# EasyEDA Pro project 扩展30.5V0.25_AT32F435_2025-06-26.epro, schematic IFLIGHT 435/405_0.25
Board Name: 扩展30.5V0.25_AT32F435; Create Date: 2025-06-26; Page Name: P1; Project Name: 低成本F405飞控; Schematic Name: IFLIGHT 435/405_0.25; Update Date: 2025-06-26; Company: 嘉立创EDA; Page Size: A4; Version: V1.0
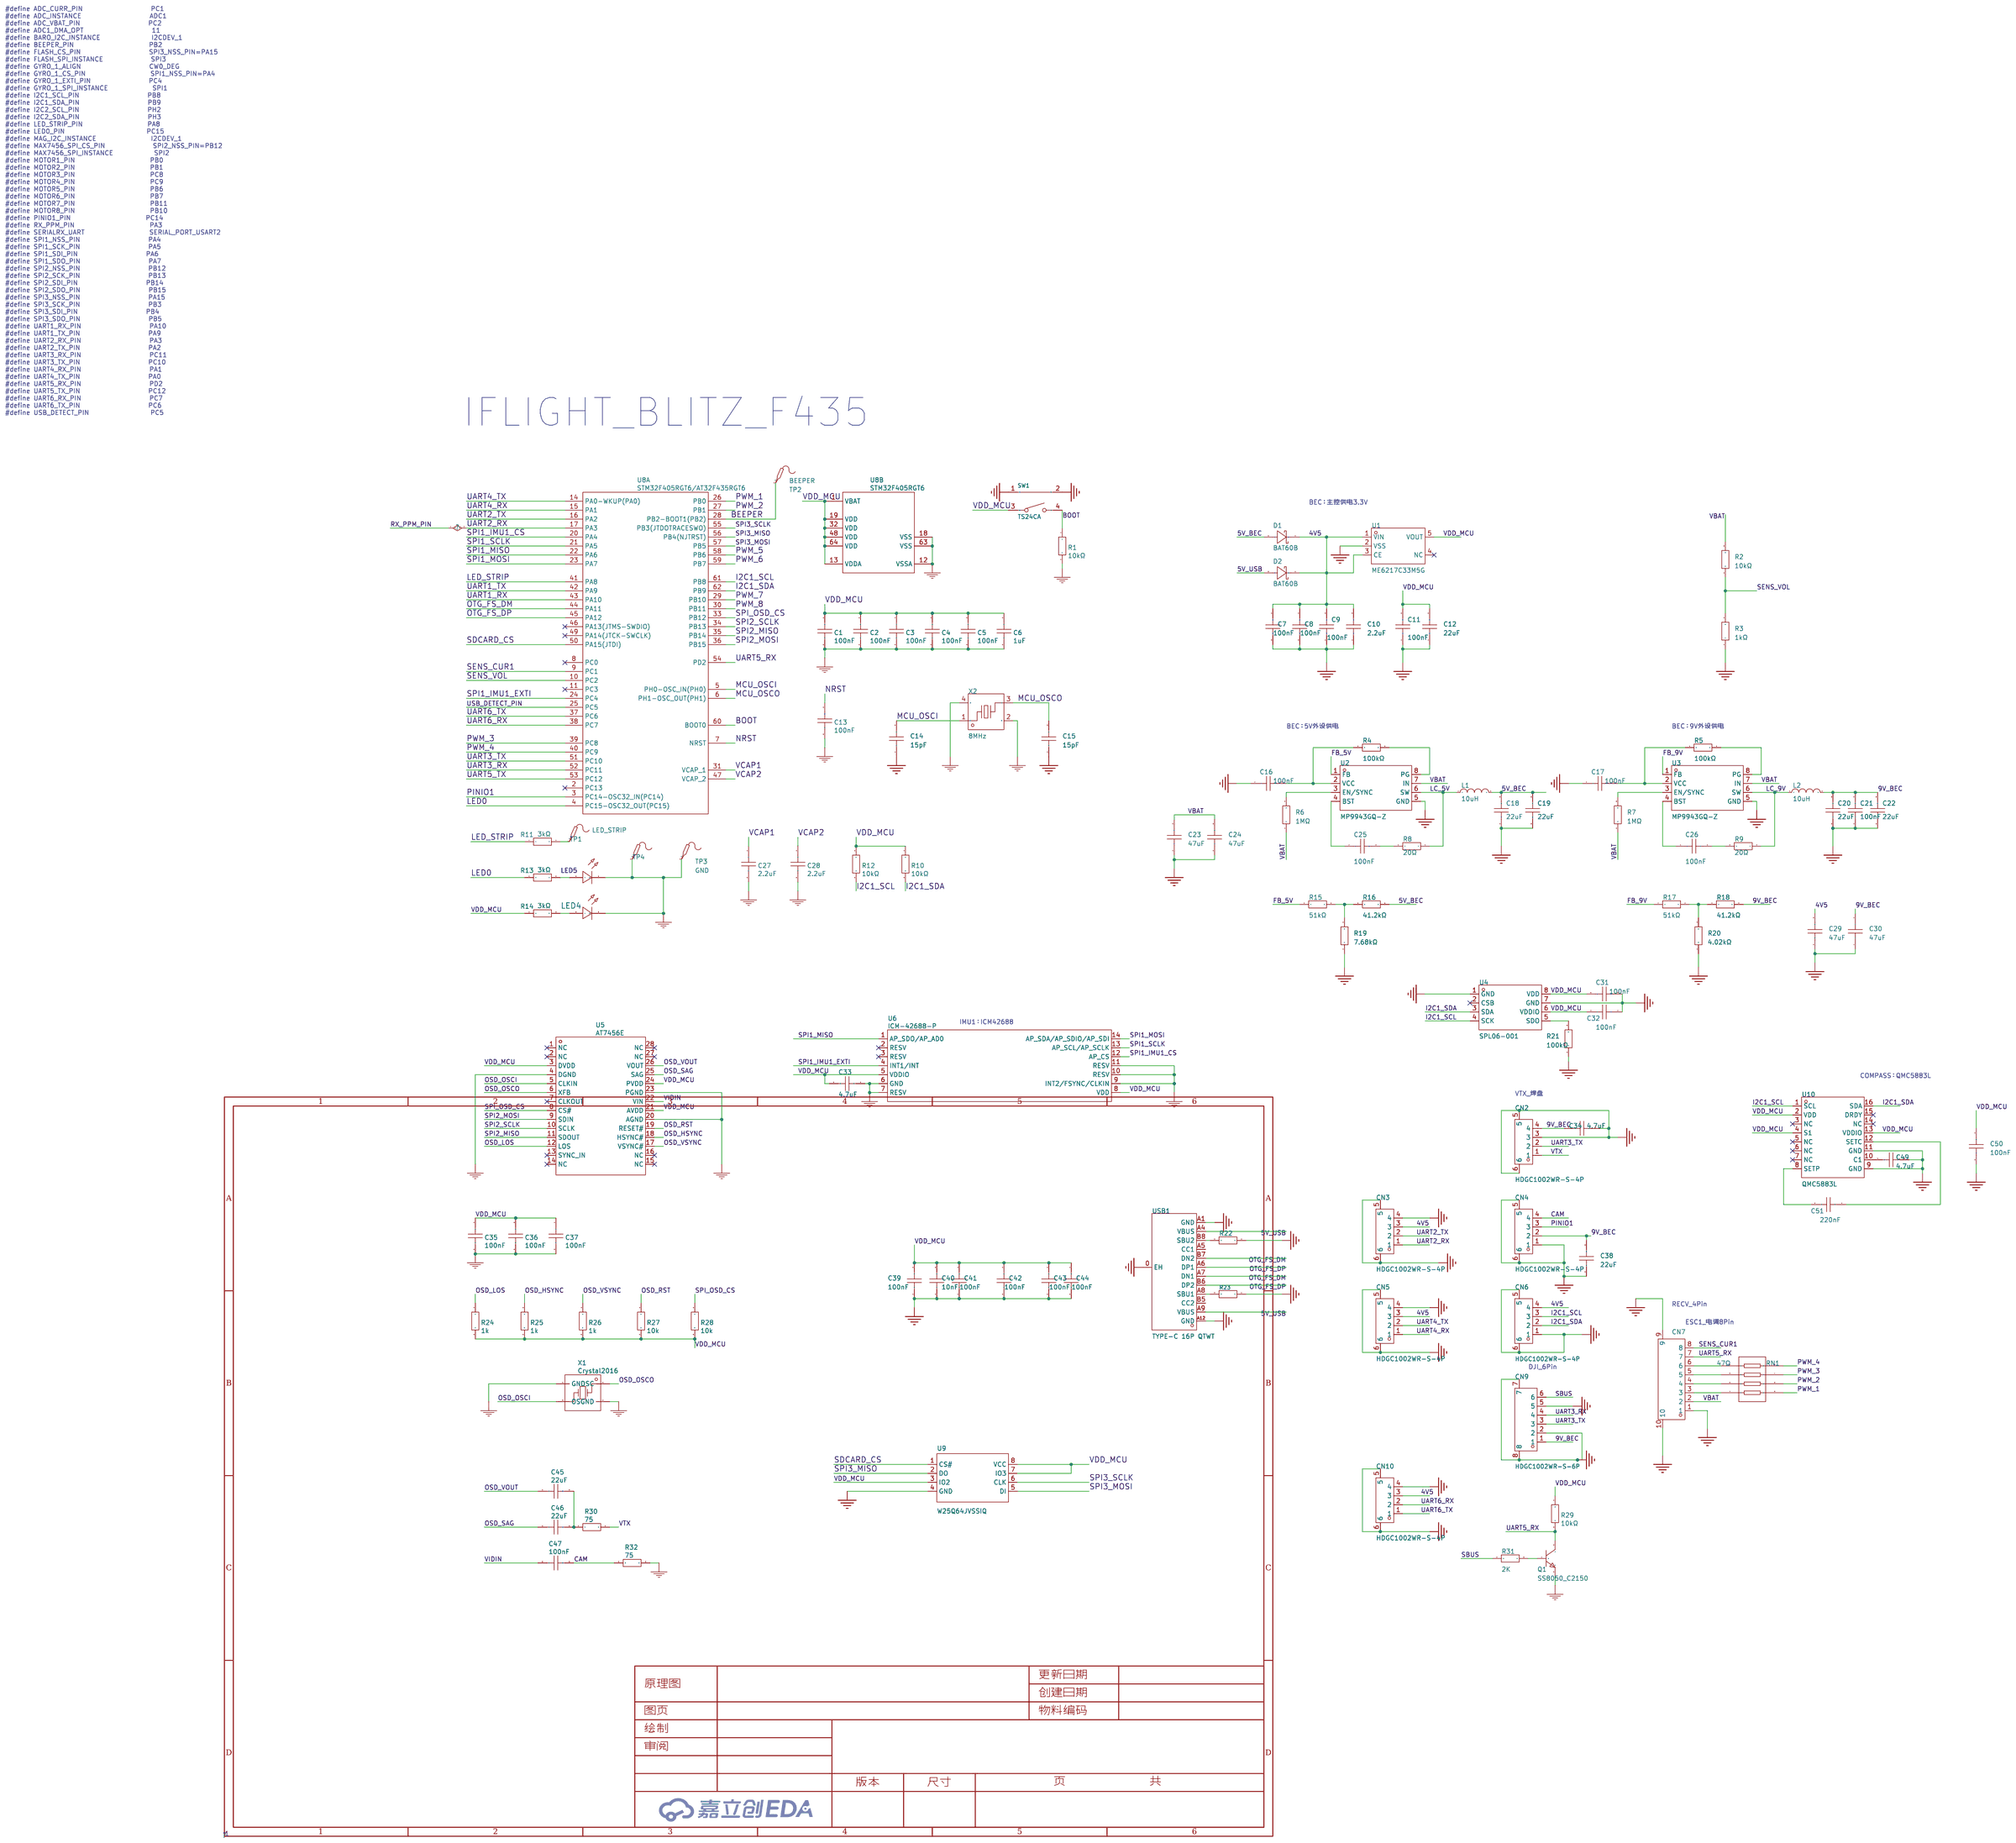
[diagram p0: schematic sheet]

## Parts
C1  100nF  [R0402]
C2  100nF  [R0402]
C3  100nF  [R0402]
C4  100nF  [R0402]
C5  100nF  [R0402]
C6  1uF  [R0402]
C7  100nF  [R0402]
C8  100nF  [R0402]
C9  100nF  [R0402]
C10  2.2uF  [R0402]
C11  100nF  [C0603]
C12  22uF  [C0603]
C13  100nF  [R0402]
C14  15pF  [C0402]
C15  15pF  [C0402]
C16  100nF  [C0402]
C17  100nF  [C0402]
C18  22uF  [C0603]
C19  22uF  [C0603]
C20  22uF  [C0603]
C21  100nF  [C0603]
C22  22uF  [C0603]
C23  47uF  [C1206]
C24  47uF  [C1206]
C25  100nF  [C0402]
C26  100nF  [C0402]
C27  2.2uF  [R0402]
C28  2.2uF  [R0402]
C29  47uF  [C1206]
C30  47uF  [C1206]
C31  100nF  [C0402]
C32  100nF  [C0402]
C33  4.7uF  [C0603]
C34  4.7uF  [C0603]
C35  100nF  [C0402]
C36  100nF  [C0402]
C37  100nF  [C0402]
C38  22uF  [C0805]
C39  100nF  [C0402]
C40  10nF  [C0402]
C41  100nF  [R0402]
C42  100nF  [R0402]
C43  100nF  [R0402]
C44  100nF  [R0402]
C45  22uF  [C0402]
C46  22uF  [C0402]
C47  100nF  [C0402]
C49  4.7uF  [C0603]
C50  100nF  [C0402]
C51  220nF  [C0402]
CN2  HDGC1002WR-S-4P  [CONN-SMD_4P-P1.00_HDGC_HDGC1002WR-S-4P]
CN3  HDGC1002WR-S-4P  [CONN-SMD_4P-P1.00_HDGC_HDGC1002WR-S-4P]
CN4  HDGC1002WR-S-4P  [CONN-SMD_4P-P1.00_HDGC_HDGC1002WR-S-4P]
CN5  HDGC1002WR-S-4P  [CONN-SMD_4P-P1.00_HDGC_HDGC1002WR-S-4P]
CN6  HDGC1002WR-S-4P  [CONN-SMD_4P-P1.00_HDGC_HDGC1002WR-S-4P]
CN7  HDGC1002WR-S-8P  [CONN-SMD_8P-P1.00_HDGC_HDGC1002WR-S-8P]
CN9  HDGC1002WR-S-6P  [CONN-SMD_6P-P1.00_HDGC1002WR-S-6P]
CN10  HDGC1002WR-S-4P  [CONN-SMD_4P-P1.00_HDGC_HDGC1002WR-S-4P]
D1  BAT60B  [SOD-323_L1.7-W1.3-LS2.6-RD-1]
D2  BAT60B  [SOD-323_L1.7-W1.3-LS2.6-RD-1]
L1  10uH  [IND-SMD_L4.4-W4.2]
L2  10uH  [IND-SMD_L4.4-W4.2]
LED4  -  [LED_0603]
LED5  -  [LED_0603]
Q1  SS8050_C2150  [SOT-23-3_L2.9-W1.3-P1.90-LS2.4-BR]
R1  10kΩ  [R0402]
R2  10kΩ  [R0402]
R3  1kΩ  [R0402]
R4  100kΩ  [R0402]
R5  100kΩ  [R0402]
R6  1MΩ  [R0402]
R7  1MΩ  [R0402]
R8  20Ω  [R0402]
R9  20Ω  [R0402]
R10  10kΩ  [R0402]
R11  3kΩ  [R0402]
R12  10kΩ  [R0402]
R13  3kΩ  [R0402]
R14  3kΩ  [R0402]
R15  51kΩ  [R0402]
R16  41.2kΩ  [R0402]
R17  51kΩ  [R0402]
R18  41.2kΩ  [R0402]
R19  7.68kΩ  [R0402]
R20  4.02kΩ  [R0402]
R21  100kΩ  [R0402]
R22  5.1kΩ  [R0402]
R23  5.1kΩ  [R0402]
R24  1k  [R0402]
R25  1k  [R0402]
R26  1k  [R0402]
R27  10k  [R0402]
R28  10k  [R0402]
R29  10kΩ  [R0402]
R30  75  [R0402]
R31  2K  [R0402]
R32  75  [R0402]
RN1  47Ω  [RES-ARRAY-SMD_0402-8P-L2.0-W1.0-BL]
SW1  TS24CA  [SW-SMD_TS24CA]
TP1  LED_STRIP  [Test-Point-0.5mm]
TP2  BEEPER  [Test-Point-0.5mm]
TP3  GND  [Test-Point-0.5mm]
TP4  -  [Test-Point-0.5mm]
U1  ME6217C33M5G  [SOT-23-5_L3.0-W1.7-P0.95-LS2.8-BR]
U2  MP9943GQ-Z  [QFN-8_L3.0-W3.0-P0.65-BL]
U3  MP9943GQ-Z  [QFN-8_L3.0-W3.0-P0.65-BL]
U4  SPL06-001  [SENSOR-SMD_SPL06-001]
U5  AT7456E  [AT7456E-SHORTER-FOOTPRINT]
U6  ICM-42688-P  [LGA-14_L3.0-W2.5-P0.50-TL]
U8  STM32F405RGT6/AT32F435RGT6  [LQFP-64_L10.0-W10.0-P0.50-LS12.0-BL]  (sections 1,2)
U9  W25Q64JVSSIQ  [SOP-8_L5.3-W5.3-P1.27-LS8.0-BL]
U10  QMC5883L  [LGA-16_L3.0-W3.0-P0.50-BL_SQ]
USB1  TYPE-C 16P QTWT  [USB-TYPE-C-SMD_TYPE-C-16P-QTWT]
X1  Crystal2016  [CRYSTAL2016]
X2  8MHz  [CRYSTAL-SMD_4P-L3.2-W2.5-BL]

## Library data of the parts
C1-C5 C7 C8 C13 C41-C44 = GRM155R71H104KE14D: 容值:100nF;精度:±10%;额定电压:50V;材质(温度系数):X7R;; LCSC Part Name: 100nF ±10% 50V; Supplier Part: C77020; Manufacturer: muRata(村田); Supplier Footprint: 0402; JLCPCB Part Class: Extended Part; Datasheet: https://atta.szlcsc.com/upload/public/pdf/source/20180326/C77020_39BD49C951FF1AF0DB1F1FAC5AC1E401.pdf; Supplier: LCSC; Tolerance: ±10%; Voltage Rated: 50V; Temperature Coefficient: X7R; 3DModel: C0402_L1.0-W0.5-H0.5
C6 = GRM155R61H105KE05D: 容值:1uF;精度:±10%;额定电压:50V;材质(温度系数):X5R;; LCSC Part Name: 1uF ±10% 50V; Supplier Part: C1518208; Manufacturer: muRata(村田); Supplier Footprint: 0402; JLCPCB Part Class: Extended Part; Datasheet: https://atta.szlcsc.com/upload/public/pdf/source/20210607/3F03D47137F6EC7729AB4067EB2A6EB3.pdf; Supplier: LCSC; Tolerance: ±10%; Voltage Rated: 50V; Temperature Coefficient: X5R; 3DModel: C0402_L1.0-W0.5-H0.5
C9 C16 C17 C25 C26 C31 C32 C39 C50 C51 = GRM155R71H104KE14D: 容值:100nF;精度:±10%;额定电压:50V;材质(温度系数):X7R;; LCSC Part Name: 100nF ±10% 50V; Supplier Part: C77020; Manufacturer: muRata(村田); Supplier Footprint: 0402; JLCPCB Part Class: Extended Part; Datasheet: https://atta.szlcsc.com/upload/public/pdf/source/20180326/C77020_39BD49C951FF1AF0DB1F1FAC5AC1E401.pdf; Supplier: LCSC; Tolerance: ±10%; Voltage Rated: 50V; Temperature Coefficient: X7R
C10 = CGA0402X5R225K350GT: 容值:2.2uF;精度:±10%;额定电压:35V;材质(温度系数):X5R;; LCSC Part Name: 2.2uF ±10% 35V; Supplier Part: C6119793; Manufacturer: HRE(芯声); Supplier Footprint: 0402; JLCPCB Part Class: Extended Part; Datasheet: https://atta.szlcsc.com/upload/public/pdf/source/20160218/1457707763339.pdf; Supplier: LCSC; Tolerance: ±10%; Voltage Rated: 35V; Temperature Coefficient: X5R
C11 C21 = 0603B104K500NT: 容值:100nF;精度:±10%;额定电压:50V;材质(温度系数):X7R;; LCSC Part Name: 100nF ±10% 50V; Supplier Part: C30926; Manufacturer: FH(风华); Supplier Footprint: 0603; JLCPCB Part Class: Extended Part; Datasheet: https://atta.szlcsc.com/upload/public/pdf/source/20200305/C486355_26A10D38EF8C2A5C37091D0039909270.pdf; Supplier: LCSC; Tolerance: ±10%; Voltage Rated: 50V; Temperature Coefficient: X7R
C12 C18-C20 C22 = CL10A226MQ8NRNC: 容值:22uF;精度:±20%;额定电压:6.3V;材质(温度系数):X5R;; LCSC Part Name: 22uF ±20% 6.3V; Supplier Part: C59461; Manufacturer: SAMSUNG(三星); Supplier Footprint: 0603; JLCPCB Part Class: Basic Part; Datasheet: https://atta.szlcsc.com/upload/public/pdf/source/20160218/1457707763339.pdf; Supplier: LCSC; Tolerance: ±20%; Voltage Rated: 6.3V; Temperature Coefficient: X5R
C14 C15 = CAP_0402: Supplier Footprint: 0402
C23 C24 C29 C30 = CL31A476MPHNNNE: 容值:47uF;精度:±20%;额定电压:10V;材质(温度系数):X5R;; LCSC Part Name: 47uF ±20% 10V; Supplier Part: C96123; Manufacturer: SAMSUNG(三星); Supplier Footprint: 1206; JLCPCB Part Class: Basic Part; Datasheet: https://atta.szlcsc.com/upload/public/pdf/source/20170228/1488267692219.pdf; Supplier: LCSC; Tolerance: ±20%; Voltage Rated: 10V; Temperature Coefficient: X5R
C27 C28 = CGA0402X5R225K350GT: 容值:2.2uF;精度:±10%;额定电压:35V;材质(温度系数):X5R;; LCSC Part Name: 2.2uF ±10% 35V; Supplier Part: C6119793; Manufacturer: HRE(芯声); Supplier Footprint: 0402; JLCPCB Part Class: Extended Part; Supplier: LCSC; Tolerance: ±10%; Voltage Rated: 35V; Temperature Coefficient: X5R; 3DModel: C0402_L1.0-W0.5-H0.5
C33 = 4.7uF: link: https://item.szlcsc.com/15869.html; 3DModel: C0402_L1.0-W0.5-H0.5; Supplier: LCSC; Supplier Part: C307423; Manufacturer: Samsung Electro-Mechanics; Manufacturer Part: CL05A475MQ5NRNC; JLCPCB Part Class: Extended Part
C34 C49 = CAP_0603: Supplier Footprint: 0603
C35-C37 C47 = 100nF: 3DModel: C0402_L1.0-W0.5-H0.5
C38 = CL21A226MAYNNNE: 容值:22uF;精度:±20%;额定电压:25V;材质(温度系数):X5R;; LCSC Part Name: 22uF ±20% 25V; Supplier Part: C602037; Manufacturer: SAMSUNG(三星); Supplier Footprint: 0805; JLCPCB Part Class: Extended Part; Datasheet: https://atta.szlcsc.com/upload/public/pdf/source/20200609/C602037_1A0D619693E608A1BF6E80154254E2DB.pdf; Supplier: LCSC; Tolerance: ±20%; Voltage Rated: 25V; Temperature Coefficient: X5R; Origin Footprint 2: 0805C
C40 = CC0402KRX7R9BB103: 容值:10nF;精度:±10%;额定电压:50V;材质(温度系数):X7R;; LCSC Part Name: 10nF ±10% 50V; Supplier Part: C60133; Manufacturer: YAGEO(国巨); Supplier Footprint: 0402; JLCPCB Part Class: Extended Part; Datasheet: https://atta.szlcsc.com/upload/public/pdf/source/20180224/C181747_15194369449651363981.pdf; Supplier: LCSC; Tolerance: ±10%; Voltage Rated: 50V; Temperature Coefficient: X7R
C45 C46 = CGA0402X5R226M100GT: 容值:22uF;精度:±20%;额定电压:10V;材质(温度系数):X5R;; LCSC Part Name: 22uF ±20% 10V; Supplier Part: C6119813; Manufacturer: HRE(芯声); Supplier Footprint: 0402; JLCPCB Part Class: Extended Part; Supplier: LCSC; Tolerance: ±20%; Voltage Rated: 10V; Temperature Coefficient: X5R; 3DModel: C0603_L1.6-W0.8-H0.8
CN2-CN6 CN10 = HDGC1002WR-S-4P: SH1.0针座卧贴 4P; LCSC Part Name: SH1.0针座卧贴 4P; Supplier Part: C2936214; Manufacturer: HDGC(华德共创); Supplier Footprint: SMD,P=1mm; JLCPCB Part Class: 扩展库; Datasheet: https://atta.szlcsc.com/upload/public/pdf/source/20211229/E8A09E85670B5E97244D2008A24D97FE.pdf; Supplier: LCSC
CN7 = HDGC1002WR-S-8P: 参考系列:SH;间距:1mm;排数:1;每排PIN数:8;公母:公型插针;安装方式:卧贴;额定电流:1A;工作温度范围:-40℃~+85℃;; LCSC Part Name: SH 1mm 卧贴; Supplier Part: C3041142; Manufacturer: HDGC(华德共创); Supplier Footprint: SMD,P=1mm; JLCPCB Part Class: 扩展库; Datasheet: https://atta.szlcsc.com/upload/public/pdf/source/20220621/C2AA6A1A2A279F73FC0521BA202CB6E2.pdf; Supplier: LCSC; Reference Series: SH; Pitch: 1mm; Number of Rows: 1; Number of PINs Per Row: 8; Gender: 公型插针; Mounting Style: 卧贴; Current Rating (Max): 1A; Operating Temperature Range: -40℃~+85℃
CN9 = HDGC1002WR-S-6P: 参考系列:SH;间距:1mm;排数:1;每排PIN数:6;公母:公型插针;安装方式:卧贴;额定电流:1A;工作温度范围:-40℃~+85℃;; LCSC Part Name: SH 1mm 卧贴; Supplier Part: C3041141; Manufacturer: HDGC(华德共创); Supplier Footprint: SMD,P=1mm; JLCPCB Part Class: 扩展库; Datasheet: https://atta.szlcsc.com/upload/public/pdf/source/20220621/C2AA6A1A2A279F73FC0521BA202CB6E2.pdf; Supplier: LCSC; Reference Series: SH; Pitch: 1mm; Number of Rows: 1; Number of PINs Per Row: 6; Gender: 公型插针; Mounting Style: 卧贴; Current Rating (Max): 1A; Operating Temperature Range: -40℃~+85℃
D1 = BAT60B_C7502695: 二极管配置:独立式;正向压降(Vf):600mV@1A;直流反向耐压(Vr):10V;整流电流:3A;; LCSC Part Name: 电压:10V 电流:3A; Supplier Part: C7502695; Manufacturer: 宏迦橙; Supplier Footprint: SOD-323; JLCPCB Part Class: Extended Part; Datasheet: https://atta.szlcsc.com/upload/public/pdf/source/20230828/25AE167151E881636AF68D9C9ECB5F9C.pdf; Supplier: LCSC; Diode Configuration: 独立式; Forward Voltage (Vf@If): 600mV@1A; Reverse Voltage (Vr): 10V; Rectified Current: 3A; Reverse Leakage Current (Ir): 25uA
D2 = BAT60B_C7502695: 二极管配置:独立式;正向压降(Vf):600mV@1A;直流反向耐压(Vr):10V;整流电流:3A;; LCSC Part Name: 电压:10V 电流:3A; Supplier Part: C7502695; Manufacturer: 宏迦橙; Supplier Footprint: SOD-323; JLCPCB Part Class: Extended Part; Datasheet: https://atta.szlcsc.com/upload/public/pdf/source/20230828/25AE167151E881636AF68D9C9ECB5F9C.pdf; Supplier: LCSC; Diode Configuration: 独立式; Forward Voltage (Vf@If): 600mV@1A; Reverse Voltage (Vr): 10V; Rectified Current: 3A; Reverse Leakage Current (Ir): 25uA; Average Rectified Current (Io): 3A
L1 L2 = FXL0420-100-M: 电感值:10uH;精度:±20%;额定电流:1.6A;饱和电流(Isat):2.2A;类型:一体成型电感;; LCSC Part Name: 10uH ±20% 2.2A; Supplier Part: C177242; Manufacturer: cjiang(长江微电); Supplier Footprint: SMD,4.2x4.4mm; JLCPCB Part Class: Extended Part; Datasheet: https://atta.szlcsc.com/upload/public/pdf/source/20200117/C485363_A2440626DC7482D75DD0DD56D1883FBF.pdf; Supplier: LCSC; Tolerance: ±20%; Rated Current: 1.6A; Saturation Current (Isat): 2.2A; DC Resistance (DCR): 282mΩ; Type: 一体成型电感
LED4 = LED_0603-R: Supplier Footprint: 0603
LED5 = LED_0603-G: Supplier Footprint: 0603
Q1 = SS8050_C2150: link: https://www.diodes.com/assets/Package-Files/SOT23.pdf; 3DModel: SOT-23-3P_L2.9-W1.3-H1.0-LS2.4-P0.95; Supplier: LCSC; Manufacturer: CJ; Manufacturer Part: SS8050; Supplier Part: C2150; JLCPCB Part Class: Basic Part
R1 R10 R12 R29 = RC0402FR-0710KL: 电阻类型:厚膜电阻;阻值:10kΩ;精度:±1%;功率:62.5mW;最大工作电压:50V;温度系数:±100ppm/℃;; LCSC Part Name: 厚膜电阻 10kΩ ±1% 62.5mW; Supplier Part: C60490; Manufacturer: YAGEO(国巨); Supplier Footprint: 0402; JLCPCB Part Class: Extended Part; Datasheet: https://atta.szlcsc.com/upload/public/pdf/source/20170925/C131467_1506321478108990263.pdf; Supplier: LCSC; Type: 厚膜电阻; Tolerance: ±1%; Power(Watts): 62.5mW; Overload Voltage (Max): 50V; Temperature Coefficient: ±100ppm/℃; Operating Temperature Range: -55℃~+155℃; 3DModel: R0402_L1.0-W0.5-H0.4
R2 = RC0402FR-0710KL: 电阻类型:厚膜电阻;阻值:10kΩ;精度:±1%;功率:62.5mW;最大工作电压:50V;温度系数:±100ppm/℃;; LCSC Part Name: 厚膜电阻 10kΩ ±1% 62.5mW; Supplier Part: C60490; Manufacturer: YAGEO(国巨); Supplier Footprint: 0402; JLCPCB Part Class: Extended Part; Datasheet: https://atta.szlcsc.com/upload/public/pdf/source/20170925/C131467_1506321478108990263.pdf; Supplier: LCSC; Type: 厚膜电阻; Tolerance: ±1%; Power(Watts): 62.5mW; Overload Voltage (Max): 50V; Temperature Coefficient: ±100ppm/℃; Operating Temperature Range: -55℃~+155℃
R3 = 0402WGF1001TCE: 电阻类型:厚膜电阻;阻值:1kΩ;精度:±1%;功率:62.5mW;最大工作电压:50V;温度系数:±100ppm/℃;; LCSC Part Name: 1kΩ ±1% 62.5mW 厚膜电阻; Supplier Part: C11702; Manufacturer: UNI-ROYAL(厚声); Supplier Footprint: 0402; JLCPCB Part Class: Basic Part; Datasheet: https://atta.szlcsc.com/upload/public/pdf/source/20200306/C422600_1E6D84923E4A46A82E41ADD87F860B5C.pdf; Supplier: LCSC; Type: 厚膜电阻; Tolerance: ±1%; Power(Watts): 62.5mW; Overload Voltage (Max): 50V; Temperature Coefficient: ±100ppm/℃; Operating Temperature Range: -55℃~+155℃
R4 R5 R21 = RC0402FR-07100KL: 电阻类型:厚膜电阻;阻值:100kΩ;精度:±1%;功率:62.5mW;最大工作电压:50V;温度系数:±100ppm/℃;; LCSC Part Name: 厚膜电阻 100kΩ ±1% 62.5mW; Supplier Part: C60491; Manufacturer: YAGEO(国巨); Supplier Footprint: 0402; JLCPCB Part Class: Extended Part; Datasheet: https://atta.szlcsc.com/upload/public/pdf/source/20180927/C295883_E8D83085EA81BD7DE0B2B681138C15EE.pdf; Supplier: LCSC; Type: 厚膜电阻; Tolerance: ±1%; Power(Watts): 62.5mW; Overload Voltage (Max): 50V; Temperature Coefficient: ±100ppm/℃; Operating Temperature Range: -55℃~+155℃
R6 R7 = 0402WGF1004TCE: 电阻类型:厚膜电阻;阻值:1MΩ;精度:±1%;功率:62.5mW;最大工作电压:50V;温度系数:±100ppm/℃;; LCSC Part Name: 1MΩ ±1% 62.5mW 厚膜电阻; Supplier Part: C26083; Manufacturer: UNI-ROYAL(厚声); Supplier Footprint: 0402; JLCPCB Part Class: Basic Part; Datasheet: https://atta.szlcsc.com/upload/public/pdf/source/20200306/C422600_1E6D84923E4A46A82E41ADD87F860B5C.pdf; Supplier: LCSC; Type: 厚膜电阻; Tolerance: ±1%; Power(Watts): 62.5mW; Overload Voltage (Max): 50V; Temperature Coefficient: ±100ppm/℃; Operating Temperature Range: -55℃~+155℃
R8 R9 = 0402WGF200JTCE: 电阻类型:厚膜电阻;阻值:20Ω;精度:±1%;功率:62.5mW;最大工作电压:50V;温度系数:±200ppm/℃;; LCSC Part Name: 20Ω ±1% 62.5mW 厚膜电阻; Supplier Part: C25089; Manufacturer: UNI-ROYAL(厚声); Supplier Footprint: 0402; JLCPCB Part Class: Extended Part; Datasheet: https://atta.szlcsc.com/upload/public/pdf/source/20200306/C422600_1E6D84923E4A46A82E41ADD87F860B5C.pdf; Supplier: LCSC; Type: 厚膜电阻; Tolerance: ±1%; Power(Watts): 62.5mW; Overload Voltage (Max): 50V; Temperature Coefficient: ±200ppm/℃; Operating Temperature Range: -55℃~+155℃
R11 R13 R14 = 0402WGF1001TCE: 电阻类型:厚膜电阻;阻值:1kΩ;精度:±1%;功率:62.5mW;最大工作电压:50V;温度系数:±100ppm/℃;; LCSC Part Name: 1kΩ ±1% 62.5mW 厚膜电阻; Supplier Part: C11702; Manufacturer: UNI-ROYAL(厚声); Supplier Footprint: 0402; JLCPCB Part Class: Basic Part; Datasheet: https://atta.szlcsc.com/upload/public/pdf/source/20200306/C422600_1E6D84923E4A46A82E41ADD87F860B5C.pdf; Supplier: LCSC; Type: 厚膜电阻; Tolerance: ±1%; Power(Watts): 62.5mW; Overload Voltage (Max): 50V; Temperature Coefficient: ±100ppm/℃; Operating Temperature Range: -55℃~+155℃; 3DModel: R0402_L1.0-W0.5-H0.4
R15 R17 = 0402WGF5102TCE: 电阻类型:厚膜电阻;阻值:51kΩ;精度:±1%;功率:62.5mW;最大工作电压:50V;温度系数:±100ppm/℃;; LCSC Part Name: 51kΩ ±1% 62.5mW 厚膜电阻; Supplier Part: C25794; Manufacturer: UNI-ROYAL(厚声); Supplier Footprint: 0402; JLCPCB Part Class: Basic Part; Datasheet: https://atta.szlcsc.com/upload/public/pdf/source/20200306/C422600_1E6D84923E4A46A82E41ADD87F860B5C.pdf; Supplier: LCSC; Type: 厚膜电阻; Tolerance: ±1%; Power(Watts): 62.5mW; Overload Voltage (Max): 50V; Temperature Coefficient: ±100ppm/℃; Operating Temperature Range: -55℃~+155℃
R16 R18 = 0402WGF4122TCE: 电阻类型:厚膜电阻;阻值:41.2kΩ;精度:±1%;功率:62.5mW;最大工作电压:50V;温度系数:±100ppm/℃;; LCSC Part Name: 41.2kΩ ±1% 62.5mW 厚膜电阻; Supplier Part: C26978; Manufacturer: UNI-ROYAL(厚声); Supplier Footprint: 0402; JLCPCB Part Class: Extended Part; Datasheet: https://atta.szlcsc.com/upload/public/pdf/source/20200306/C422600_1E6D84923E4A46A82E41ADD87F860B5C.pdf; Supplier: LCSC; Type: 厚膜电阻; Tolerance: ±1%; Power(Watts): 62.5mW; Overload Voltage (Max): 50V; Temperature Coefficient: ±100ppm/℃; Operating Temperature Range: -55℃~+155℃
R19 = 0402WGF7681TCE: 电阻类型:厚膜电阻;阻值:7.68kΩ;精度:±1%;功率:62.5mW;最大工作电压:50V;温度系数:±100ppm/℃;; LCSC Part Name: 7.68kΩ ±1% 62.5mW 厚膜电阻; Supplier Part: C25919; Manufacturer: UNI-ROYAL(厚声); Supplier Footprint: 0402; JLCPCB Part Class: Extended Part; Datasheet: https://atta.szlcsc.com/upload/public/pdf/source/20200306/C422600_1E6D84923E4A46A82E41ADD87F860B5C.pdf; Supplier: LCSC; Type: 厚膜电阻; Tolerance: ±1%; Power(Watts): 62.5mW; Overload Voltage (Max): 50V; Temperature Coefficient: ±100ppm/℃; Operating Temperature Range: -55℃~+155℃
R20 = 0402WGF4021TCE: 电阻类型:厚膜电阻;阻值:4.02kΩ;精度:±1%;功率:62.5mW;最大工作电压:50V;温度系数:±100ppm/℃;; LCSC Part Name: 4.02kΩ ±1% 62.5mW 厚膜电阻; Supplier Part: C43251; Manufacturer: UNI-ROYAL(厚声); Supplier Footprint: 0402; JLCPCB Part Class: Extended Part; Datasheet: https://atta.szlcsc.com/upload/public/pdf/source/20200306/C422600_1E6D84923E4A46A82E41ADD87F860B5C.pdf; Supplier: LCSC; Type: 厚膜电阻; Tolerance: ±1%; Power(Watts): 62.5mW; Overload Voltage (Max): 50V; Temperature Coefficient: ±100ppm/℃; Operating Temperature Range: -55℃~+155℃
R22 R23 = 0402WGF5101TCE: 电阻类型:厚膜电阻;阻值:5.1kΩ;精度:±1%;功率:62.5mW;最大工作电压:50V;温度系数:±100ppm/℃;; LCSC Part Name: 5.1kΩ ±1% 62.5mW 厚膜电阻; Supplier Part: C25905; Manufacturer: UNI-ROYAL(厚声); Supplier Footprint: 0402; JLCPCB Part Class: Basic Part; Datasheet: https://atta.szlcsc.com/upload/public/pdf/source/20200306/C422600_1E6D84923E4A46A82E41ADD87F860B5C.pdf; Supplier: LCSC; Type: 厚膜电阻; Tolerance: ±1%; Power(Watts): 62.5mW; Overload Voltage (Max): 50V; Temperature Coefficient: ±100ppm/℃; Operating Temperature Range: -55℃~+155℃; link: https://item.szlcsc.com/323315.html; 3DModel: R0402_L1.0-W0.5-H0.5; Resistance: 5.1K; Standardization Check: true
R24-R26 = 1k: 3DModel: R0402_L1.0-W0.5-H0.4; Supplier: LCSC
R27 R28 = 10k: 3DModel: R0402_L1.0-W0.5-H0.4; Supplier: LCSC
R30 R32 = 75: 3DModel: R0402_L1.0-W0.5-H0.4; Supplier: LCSC
R31 = Res_0402: Supplier Footprint: 0402
RN1 = AF124-JR-0747RL: 电阻器数:4;阻值:47Ω;精度:±5%;单个元件功率:62.5mW;温度系数:±200ppm/℃;; LCSC Part Name: 47Ω ±5% 0402x4; Supplier Part: C723467; Manufacturer: YAGEO(国巨); Supplier Footprint: 0402x4; JLCPCB Part Class: Extended Part; Datasheet: https://atta.szlcsc.com/upload/public/pdf/source/20200817/C723467_726CADB538F6405BDC12AAE9A767035C.pdf; Supplier: LCSC; Number of Resistors: 4; Tolerance: ±5%; Power(Watts): 62.5mW; Temperature Coefficient: ±200ppm/℃; Number of Pins: 8
SW1 = TS24CA: 触点电流:50mA;额定电压(DC):12V;电路结构:单刀单掷;安装方式:卧贴;带灯:-;机械寿命:-;; LCSC Part Name: 4.55*1.8*3.5mm 卧贴 轻触开关; Supplier Part: C393942; Manufacturer: SHOU HAN(首韩); Supplier Footprint: SMD; JLCPCB Part Class: 扩展库; Datasheet: https://atta.szlcsc.com/upload/public/pdf/source/20190521/C393942_591A9E318887EFA4274D34029981AD99.pdf; Supplier: LCSC; Contact Current: 50mA; Voltage Rating (DC): 12V; Circuit: 单刀单掷; Mounting Style: 卧贴; Actuator Style: 矩形按钮; Switch Length: 4.55mm; Switch Width: 1.8mm; Switch Height: 3.5mm
TP1-TP4 = Test-Point: Test Point 测试点
U1 = ME6217C33M5G: 输出类型:固定;输出极性:正;最大输入电压:7V;输出电压:3.3V;输出电流:800mA;电源纹波抑制比(PSRR):65dB@(1kHz);; Supplier Part: C427602; Manufacturer: MICRONE(南京微盟); Supplier Footprint: SOT-23-5; JLCPCB Part Class: 扩展库; Datasheet: https://atta.szlcsc.com/upload/public/pdf/source/20190910/C427602_D4B9162A2E9D9EF57C60010DFDECEF37.pdf; Supplier: LCSC; Output Type: 固定; Output Polarity: 正; Number of Outputs: 1; Maximum Input Voltage: 7V; Output Voltage: 3.3V; Dropout Voltage: 180mV@(300mA); Output Current: 800mA; Power Supply Rejection Ratio (PSRR): 65dB@(1kHz)
U2 U3 = MP9943GQ-Z: Supplier Part: C477821; Supplier Footprint: QFN-8_3x3mm; JLCPCB Part Class: 扩展库; Datasheet: 2021-05-22/374398S/94eb60b6438e46f987ac1f72df989e4b/MP9943.pdf; Supplier: LCSC; Standardization Check: true
U4 = SPL06-001_C2684428: LCSC Part Name: 普通气压传感器; Supplier Part: C2684428; Manufacturer: Goertek(歌尔); Supplier Footprint: SMD-8P,2x2.5mm; JLCPCB Part Class: 扩展库; Datasheet: https://atta.szlcsc.com/upload/public/pdf/source/20210120/C2684428_7EA58BBCA3793458F617124FBE4BF8F1.pdf; Supplier: LCSC
U5 = AT7456E: 3DModel: HTSSOP-28_L9.7-W4.4-P0.65-LS6.4-BL-EP-2
U6 = ICM-42688-P: 传感器类型:加速度计陀螺仪;; Supplier Part: C1850418; Manufacturer: TDK InvenSense(应美盛); Supplier Footprint: LGA-14(2.5x3); JLCPCB Part Class: 扩展库; Datasheet: https://atta.szlcsc.com/upload/public/pdf/source/20210703/CF24204867ACE5B754A2B035F23E5931.pdf; Supplier: LCSC; Sensor Type: 加速度计陀螺仪; link: https://lcsc.com/product-detail/Sensors_Bosch_BMG250_BMG250_C189521.html; 3DModel: LGA-14_L2.5-W3.0-H0.9-P0.50
U8 = STM32F405RGT6: link: https://item.szlcsc.com/92458.html; 3DModel: LQFP-64_L10.0-W10.0-H1.4-LS12.0-P0.50; tags: STM32; Supplier Part: C15742; Supplier: LCSC; Manufacturer: ST; image: http://image.lceda.cn/szlcsc/C15742.jpg; JLCPCB Part Class: Extended Part
U9 = W25Q64JVSSIQ_C83140: 接口类型:SPI;存储容量:-;时钟频率(fc):133MHz;; Supplier Part: C83140; Manufacturer: WINBOND(华邦); Supplier Footprint: SOP-8-208mil; JLCPCB Part Class: 扩展库; Datasheet: https://atta.szlcsc.com/upload/public/pdf/source/20161110/1478742546019.pdf; Supplier: LCSC; Interface: SPI; Clock Frequency: 133MHz; Voltage - Supply: 3V~3.6V; Page Programming Time (Tpp): 3ms; Data Retention - TDR (Year): 20年
U10 = QMC5883L: LCSC Part Name: 三轴磁传感器; Supplier Part: C976032; Manufacturer: QST(上海矽睿); Supplier Footprint: LGA-16(3x3x0.9); JLCPCB Part Class: 扩展库; Datasheet: https://atta.szlcsc.com/upload/public/pdf/source/20201217/C976032_5B9A2F3901E175046CBA037B1F18A1F2.pdf; Supplier: LCSC
USB1 = TYPE-C 16P QTWT: 连接器类型:Type-C;标准:-;公母:母;端口数量:1;触点数量:16P;安装方式:卧贴;额定电流 - 电源:3A;触头材质:-;触头镀层:-;工作温度范围:-25℃~+85℃;焊接温度(最大值):-;; LCSC Part Name: Type-C 母 卧贴; Supplier Part: C5187472; Manufacturer: SHOU HAN(首韩); Supplier Footprint: SMD; JLCPCB Part Class: 扩展库; Datasheet: https://atta.szlcsc.com/upload/public/pdf/source/20220929/9CA39B32C19F2C1116A695DA9353B6B2.pdf; Supplier: LCSC; Connector Type: Type-C; Gender: 母; Number of Ports: 1; Number of Contacts: 16P; Mounting Style: 卧贴; Current Rating - Power (Max): 3A; Operating Temperature Range: -25℃~+85℃
X1 = Crystal2016: 3DModel: OSC-SMD_4P-L2.0-W1.6-BL_X201624MKB4SI
X2 = X32258MSB4SI: 晶振类型:贴片晶振;频率:8MHz;常温频差:±10ppm;负载电容:20pF;频率稳定度:±20ppm;; LCSC Part Name: YSX321SL 8MHZ 4P 3225 20PF ±10PPM -40~85℃ (±20PPM); Supplier Part: C2682774; Manufacturer: YXC(扬兴晶振); Supplier Footprint: SMD3225-4P; JLCPCB Part Class: 扩展库; Datasheet: https://atta.szlcsc.com/upload/public/pdf/source/20240329/19D5F850207469550BEB00D7DFEDBC7A.pdf; Supplier: LCSC; Type: 贴片晶振; Normal temperature Frequency Tolerance: ±10ppm; Load Capacitance: 20pF; Frequency Stability: ±20ppm; Equivalent Series Resistance(ESR): 120Ω; Operating Temperature: -40℃~+85℃

## Nets
4V5: C7.1 C8.1 C9.2 C10.2 C29.2 CN3.3 CN5.3 CN6.4 CN10.3 D1.1(C) D2.1(C) U1.1(VIN) U1.3(CE)
5V_BEC: C18.2 C19.2 D1.2(A) L1.2 R16.2
5V_USB: D2.2(A) USB1.A4(VBUS) USB1.A9(VBUS)
9V_BEC: C20.2 C21.2 C22.2 C30.2 C34.1 C38.2 CN2.4 CN4.2 CN9.1 L2.2 R18.2
GND: C1.2 C2.2 C3.2 C4.2 C5.2 C6.2 C7.2 C8.2 C9.1 C10.1 C11.1 C12.1 C13.2 C14.1 C15.1 C16.1 C17.1 C18.1 C19.1 C20.1 C21.1 C22.1 C23.1 C24.1 C27.2 C28.2 C29.1 C30.1 C31.1 C32.1 C33.1 C34.2 C35.2 C36.2 C37.2 C38.1 C39.1 C40.1 C41.2 C42.2 C43.2 C44.2 C49.2 C50.2 CN2.3 CN2.5 CN2.6 CN3.4 CN3.5 CN3.6 CN4.1 CN4.5 CN4.6 CN5.4 CN5.5 CN5.6 CN6.1 CN6.5 CN6.6 CN7.1 CN7.9 CN7.10 CN9.2 CN9.5 CN9.7 CN9.8 CN10.4 CN10.5 CN10.6 LED4.1(C) LED5.1(C) Q1.2(E) R1.2 R3.1 R19.1 R20.1 R21.1 R22.1 R23.1 R32.2 SW1.1 SW1.2 TP3.1 TP4.1 U1.2(VSS) U2.5(GND) U3.5(GND) U4.1(GND) U4.7(GND) U5.4(DGND) U5.20(AGND) U5.23(PGND) U6.6(GND) U6.7(RESV) U6.9(INT2/FSYNC/CLKIN) U6.10(RESV) U6.11(RESV) U8.12(VSSA) U8.18(VSS) U8.63(VSS) U9.4(GND) U10.9(GND) U10.11(GND) USB1.0(EH) USB1.A1(GND) USB1.A12(GND) X1.2(GND) X1.4(GND) X2.2(GND) X2.4(GND)
VBAT: C23.2 C24.2 CN7.2 R2.2 R6.1 R7.1 U2.7(IN) U3.7(IN)
VDD_MCU: C1.1 C2.1 C3.1 C4.1 C5.1 C6.1 C11.2 C12.2 C31.2 C32.2 C33.2 C35.1 C36.1 C37.1 C39.2 C40.2 C41.1 C42.1 C43.1 C44.1 C50.1 R10.1 R12.1 R14.1 R24.2 R25.2 R26.2 R27.2 R28.2 R29.1 SW1.3 U1.5(VOUT) U4.6(VDDIO) U4.8(VDD) U5.3(DVDD) U5.21(AVDD) U5.24(PVDD) U6.5(VDDIO) U6.8(VDD) U8.1(VBAT) U8.13(VDDA) U8.19(VDD) U8.32(VDD) U8.48(VDD) U8.64(VDD) U9.3(IO2) U9.7(IO3) U9.8(VCC) U10.2(VDD) U10.4(S1) U10.13(VDDIO)
BEEPER: TP2.1 U8.28(PB2-BOOT1(PB2))
BOOT: R1.1 SW1.4 U8.60(BOOT0)
CAM: C47.2 CN4.4 R32.1
FB_5V: R15.1 U2.1(FB)
FB_9V: R17.1 U3.1(FB)
I2C1_SCL: CN6.3 R12.2 U4.4(SCK) U8.61(PB8) U10.1(SCL)
I2C1_SDA: CN6.2 R10.2 U4.3(SDA) U8.62(PB9) U10.16(SDA)
LC_5V: L1.1 R8.1 U2.6(SW)
LC_9V: L2.1 R9.1 U3.6(SW)
LED0: R13.1 U8.4(PC15-OSC32_OUT(PC15))
LED_STRIP: R11.1 U8.41(PA8)
MCU_OSCI: C14.2 U8.5(PH0-OSC_IN(PH0)) X2.1
MCU_OSCO: C15.2 U8.6(PH1-OSC_OUT(PH1)) X2.3
NRST: C13.1 U8.7(NRST)
OSD_HSYNC: R25.1 U5.18(HSYNC#)
OSD_LOS: R24.1 U5.12(LOS)
OSD_OSCI: U5.5(CLKIN) X1.3(OSC)
OSD_OSCO: U5.6(XFB) X1.1(OSC)
OSD_RST: R27.1 U5.19(RESET#)
OSD_SAG: C46.1 U5.25(SAG)
OSD_VOUT: C45.1 U5.26(VOUT)
OSD_VSYNC: R26.1 U5.17(VSYNC#)
OTG_FS_DM: U8.44(PA11) USB1.A7(DN1) USB1.B7(DN2)
OTG_FS_DP: U8.45(PA12) USB1.A6(DP1) USB1.B6(DP2)
PINIO1: CN4.3 U8.3(PC14-OSC32_IN(PC14))
PWM_1: RN1.5 U8.26(PB0)
PWM_2: RN1.6 U8.27(PB1)
PWM_3: RN1.7 U8.39(PC8)
PWM_4: RN1.8 U8.40(PC9)
PWM_5: U8.58(PB6)
PWM_6: U8.59(PB7)
PWM_7: U8.29(PB10)
PWM_8: U8.30(PB11)
RX_PPM_PIN: CN3.1 U8.17(PA3)
SBUS: CN9.6 R31.1
SDCARD_CS: U8.50(PA15(JTDI)) U9.1(CS#)
SENS_CUR1: CN7.8 U8.9(PC1)
SENS_VOL: R2.1 R3.2 U8.10(PC2)
SPI1_IMU1_CS: U6.12(AP_CS) U8.20(PA4)
SPI1_IMU1_EXTI: U6.4(INT1/INT) U8.24(PC4)
SPI1_MISO: U6.1(AP_SDO/AP_AD0) U8.22(PA6)
SPI1_MOSI: U6.14(AP_SDA/AP_SDIO/AP_SDI) U8.23(PA7)
SPI1_SCLK: U6.13(AP_SCL/AP_SCLK) U8.21(PA5)
SPI2_MISO: U5.11(SDOUT) U8.35(PB14)
SPI2_MOSI: U5.9(SDIN) U8.36(PB15)
SPI2_SCLK: U5.10(SCLK) U8.34(PB13)
SPI3_MISO: U8.56(PB4(NJTRST)) U9.2(DO)
SPI3_MOSI: U8.57(PB5) U9.5(DI)
SPI3_SCLK: U8.55(PB3(JTDOTRACESWO)) U9.6(CLK)
SPI_OSD_CS: R28.1 U5.8(CS#) U8.33(PB12)
UART1_RX: U8.43(PA10)
UART1_TX: U8.42(PA9)
UART2_TX: CN3.2 U8.16(PA2)
UART3_RX: CN9.4 U8.52(PC11)
UART3_TX: CN2.2 CN9.3 U8.51(PC10)
UART4_RX: CN5.1 U8.15(PA1)
UART4_TX: CN5.2 U8.14(PA0-WKUP(PA0))
UART5_RX: CN7.7 Q1.3(C) R29.2 U8.54(PD2)
UART5_TX: U8.53(PC12)
UART6_RX: CN10.2 U8.38(PC7)
UART6_TX: CN10.1 U8.37(PC6)
USB_DETECT_PIN: U8.25(PC5)
VCAP1: C27.1 U8.31(VCAP_1)
VCAP2: C28.1 U8.47(VCAP_2)
VIDIN: C47.1 U5.22(VIN)
VTX: CN2.1 R30.2
$1N935: Q1.1(B) R31.2
$1N953: LED4.2(A) R14.2
$1N1962: C45.2 C46.2 R30.1
$1N3690: R21.2 U4.5(SDO)
$1N5313: R5.2 U3.8(PG)
$1N5318: R17.2 R18.1 R20.2
$1N5320: R7.2 U3.3(EN/SYNC)
$1N5321: C26.1 U3.4(BST)
$1N5322: C17.2 R5.1 U3.2(VCC)
$1N5325: C26.2 R9.2
$1N5344: R4.2 U2.8(PG)
$1N5352: R15.2 R16.1 R19.2
$1N5360: R6.2 U2.3(EN/SYNC)
$1N5361: C16.2 R4.1 U2.2(VCC)
$1N5362: C25.1 U2.4(BST)
$1N5363: C25.2 R8.2
$1N5613: R23.2 USB1.A8(SBU1)
$1N5614: R22.2 USB1.B8(SBU2)
$1N22853: LED5.2(A) R13.2
$1N53168: CN7.3 RN1.4
$1N53172: CN7.4 RN1.3
$1N53177: CN7.5 RN1.2
$1N53182: CN7.6 RN1.1
$1N59217: C51.2 U10.8(SETP)
$1N59218: C51.1 U10.12(SETC)
$1N59220: C49.1 U10.10(C1)
Net-(R11-2): R11.2 TP1.1

Not connected (* = marked no-connect by the designer): U1 4(NC)*; U4 2(CSB)*; U5 1(NC)* 2(NC)* 7(CLKOUT)* 13(SYNC_IN)* 14(NC)* 15(NC)* 16(NC)* 27(NC)* 28(NC)*; U6 2(RESV)* 3(RESV)*; U8 2(PC13)* 8(PC0)* 11(PC3)* 46(PA13(JTMS-SWDIO))* 49(PA14(JTCK-SWCLK))*; U10 3(NC)* 5(NC)* 6(NC)* 7(NC)* 14(NC)* 15(DRDY)*; USB1 A5(CC1) B5(CC2)

## Notes on the sheet
- #define ADC_CURR_PIN                    PC1
  #define ADC_INSTANCE                    ADC1
  #define ADC_VBAT_PIN                    PC2
  #define ADC1_DMA_OPT                    11
  #define BARO_I2C_INSTANCE               I2CDEV_1
  #define BEEPER_PIN                      PB2
  #define FLASH_CS_PIN                    SPI3_NSS_PIN=PA15
  #define FLASH_SPI_INSTANCE              SPI3
  #define GYRO_1_ALIGN                    CW0_DEG
  #define GYRO_1_CS_PIN                   SPI1_NSS_PIN=PA4
  #define GYRO_1_EXTI_PIN                 PC4
  #define GYRO_1_SPI_INSTANCE             SPI1
  #define I2C1_SCL_PIN                    PB8
  #define I2C1_SDA_PIN                    PB9
  #define I2C2_SCL_PIN                    PH2
  #define I2C2_SDA_PIN                    PH3
  #define LED_STRIP_PIN                   PA8
  #define LED0_PIN                        PC15
  #define MAG_I2C_INSTANCE                I2CDEV_1
  #define MAX7456_SPI_CS_PIN              SPI2_NSS_PIN=PB12
  #define MAX7456_SPI_INSTANCE            SPI2
  #define MOTOR1_PIN                      PB0
  #define MOTOR2_PIN                      PB1
  #define MOTOR3_PIN                      PC8
  #define MOTOR4_PIN                      PC9
  #define MOTOR5_PIN                      PB6
  #define MOTOR6_PIN                      PB7
  #define MOTOR7_PIN                      PB11
  #define MOTOR8_PIN                      PB10
  #define PINIO1_PIN                      PC14
  #define RX_PPM_PIN                      PA3
  #define SERIALRX_UART                   SERIAL_PORT_USART2
  #define SPI1_NSS_PIN                    PA4
  #define SPI1_SCK_PIN                    PA5
  #define SPI1_SDI_PIN                    PA6
  #define SPI1_SDO_PIN                    PA7
  #define SPI2_NSS_PIN                    PB12
  #define SPI2_SCK_PIN                    PB13
  #define SPI2_SDI_PIN                    PB14
  #define SPI2_SDO_PIN                    PB15
  #define SPI3_NSS_PIN                    PA15
  #define SPI3_SCK_PIN                    PB3
  #define SPI3_SDI_PIN                    PB4
  #define SPI3_SDO_PIN                    PB5
  #define UART1_RX_PIN                    PA10
  #define UART1_TX_PIN                    PA9
  #define UART2_RX_PIN                    PA3
  #define UART2_TX_PIN                    PA2
  #define UART3_RX_PIN                    PC11
  #define UART3_TX_PIN                    PC10
  #define UART4_RX_PIN                    PA1
  #define UART4_TX_PIN                    PA0
  #define UART5_RX_PIN                    PD2
  #define UART5_TX_PIN                    PC12
  #define UART6_RX_PIN                    PC7
  #define UART6_TX_PIN                    PC6
  #define USB_DETECT_PIN                  PC5
- IFLIGHT_BLITZ_F435
- BEC：主控供电3.3V
- BEC：5V外设供电
- BEC：9V外设供电
- IMU1：ICM42688
- COMPASS：QMC5883L
- VTX_焊盘
- RECV_4Pin
- ESC1_电调8Pin
- DJI_6Pin
